# EAGLE design SFFV.10 (EAGLE 6.5.0)
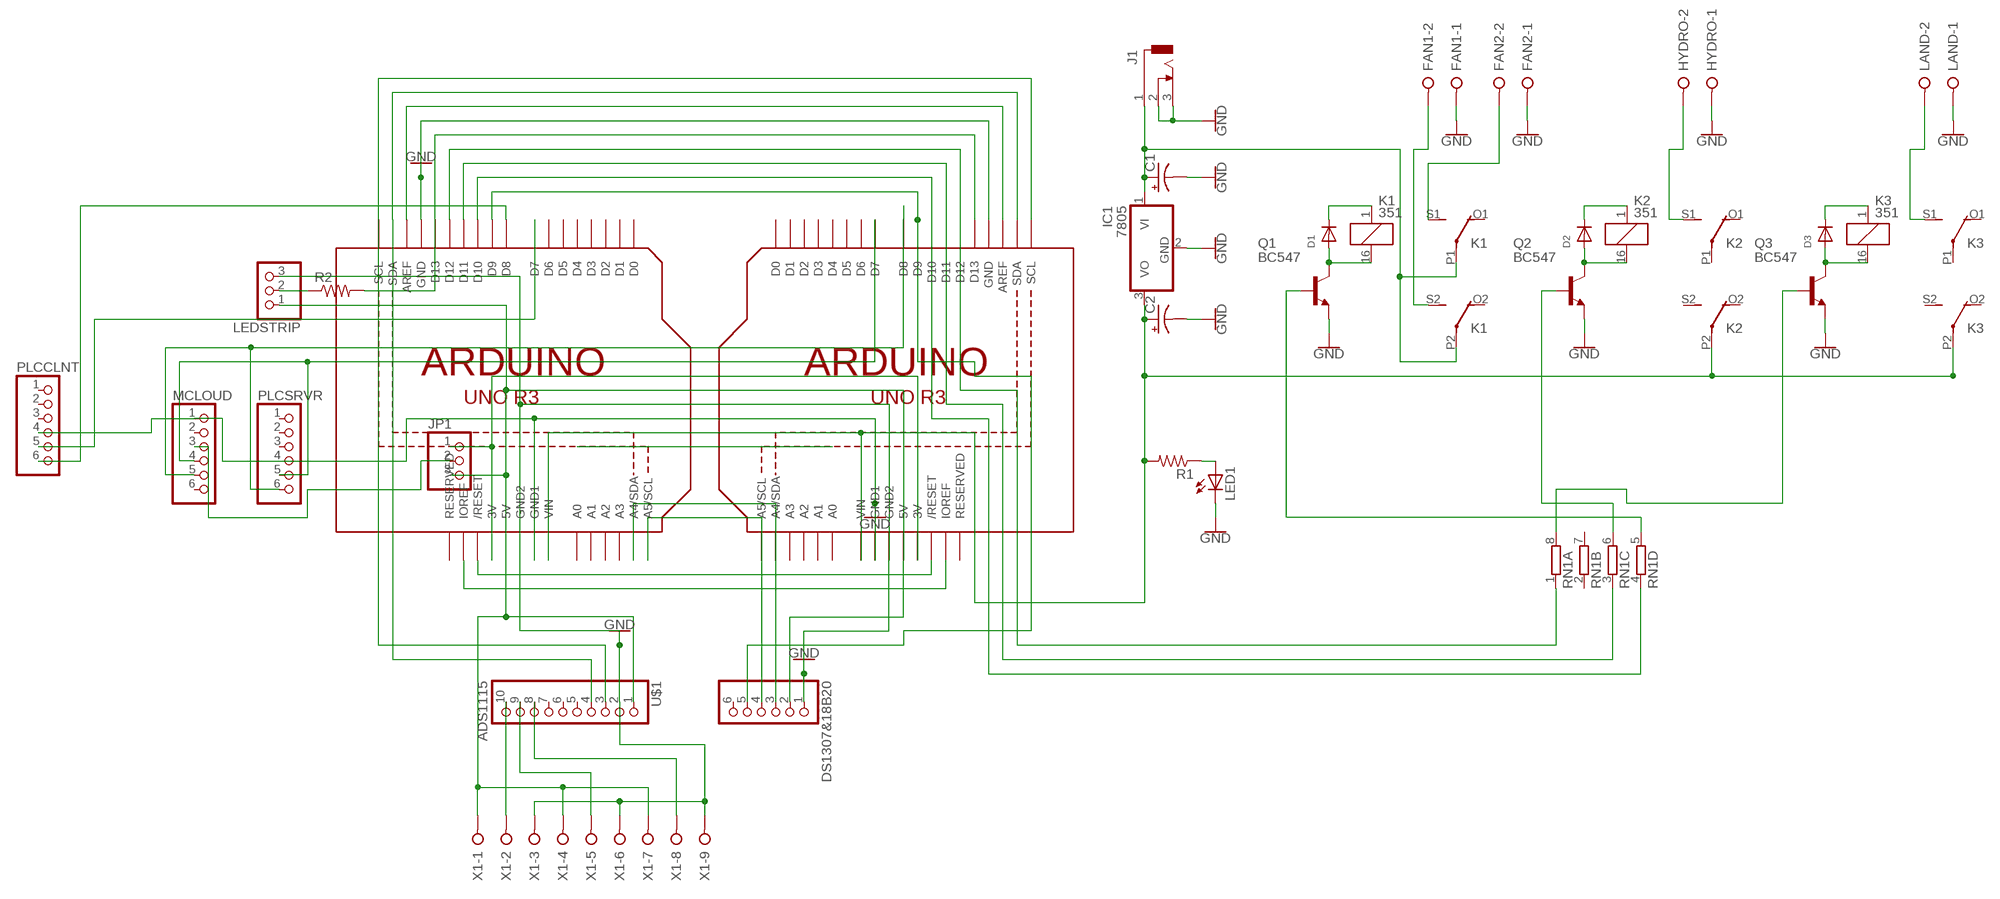
[diagram p0: schematic, sheet 1]

## Parts
C1  CPOL-USE  [PANASONIC_E]
C2  CPOL-USE  [PANASONIC_E]
D1  DIODESMA  [SMADIODE]
D2  DIODESMA  [SMADIODE]
D3  DIODESMA  [SMADIODE]
DS1307&18B20  PINHD-1X6B  [1X06-BIG]
FAN1  W237-02P  [W237-132]
FAN2  W237-02P  [W237-132]
HYDRO  W237-02P  [W237-132]
IC1  7805  7805T  [TO220H]
J1  DCJ0303  [DCJ0303]
JP1  PINHD-1X3CB  [1X03-CLEANBIG]
K1  351  [351]
K2  351  [351]
K3  351  [351]
LAND  W237-02P  [W237-132]
LED1  LED5MM  [LED5MM]
LEDSTRIP  PINHD-1X3  [1X03]
MCLOUD  PINHD-1X6B  [1X06-BIG]
PLCCLNT  PINHD-1X6B  [1X06-BIG]
PLCSRVR  PINHD-1X6B  [1X06-BIG]
Q1  BC547  [TO92]
Q2  BC547  [TO92]
Q3  BC547  [TO92]
R1  R-US_MELF0207W  [MINI_MELF-0207W]
R2  R-US_MELF0207W  [MINI_MELF-0207W]
RN1  4R-NEXB38V  [EXB38V]
U1  ARDUINOR3-BPLACE  [ARDUINOR3-BPLACE]
U2  ARDUINOR3-BPLACE  [ARDUINOR3-BPLACE]
U$1  ADS1115  PINHD-1X10  [1X10-BIG]
X1  W237-09P  [W237-9P]

## Nets
GND: C1.- C2.- DS1307&18B20.1 FAN1.1 FAN2.1 HYDRO.1 IC1.2(GND) J1.2 J1.3 LAND.1 LED1.K(C) LEDSTRIP.3 MCLOUD.1 PLCCLNT.4 PLCSRVR.4 Q1.1(E) Q2.1(E) Q3.1(E) U1.GND U1.GND1 U1.GND2 U2.GND U2.GND1 U2.GND2 U$1.2 X1.3 X1.6 X1.9
N$1: LEDSTRIP.2 R2.1
N$2: LED1.A R1.1
N$5: MCLOUD.4 PLCSRVR.5 U2.D7
N$6: JP1.2 MCLOUD.3
N$8: PLCCLNT.5 U1.D7
N$9: DS1307&18B20.4 U1.A5(A5/SCL) U2.A5(A5/SCL)
N$10: DS1307&18B20.3 U1.A4(A4/SDA) U2.A4(A4/SDA)
N$11: MCLOUD.5 PLCSRVR.6 U2.D8
N$19: JP1.1 U1.3V U2.3V
N$20: U1.RESET(/RESET) U2.RESET(/RESET)
N$21: U1.IOREF U2.IOREF
N$23: PLCCLNT.6 U1.D8
N$24: DS1307&18B20.5 U1.D9 U2.D9
N$25: RN1.4 U1.D10 U2.D10
N$26: RN1.3 U1.D11 U2.D11
N$27: RN1.1 U1.D12 U2.D12
N$28: R2.2 U1.D13 U2.D13
N$30: U1.AREF U2.AREF
N$31: U1.SDA U2.SDA U$1.4
N$32: U$1.10 X1.2
N$33: C1.+ IC1.1(VI) J1.1 K1.P1(2:P) K1.P2(3:P)
N$34: C2.+ IC1.3(VO) K2.P2(3:P) K3.P2(3:P) R1.2 U1.VIN U2.VIN
N$35: Q1.2(B) RN1.5
N$36: Q2.2(B) RN1.6
N$37: HYDRO.2 K2.S1(2:S)
N$38: Q3.2(B) RN1.8
N$39: D1.A K1.16 Q1.3(C)
N$40: D1.C K1.1
N$41: D2.A K2.16 Q2.3(C)
N$42: D2.C K2.1
N$43: D3.A K3.16 Q3.3(C)
N$44: D3.C K3.1
N$45: FAN2.2 K1.S1(2:S)
N$46: FAN1.2 K1.S2(3:S)
N$47: K3.S1(2:S) LAND.2
N$48: U$1.9 X1.5
N$49: U$1.8 X1.8
N$54: U1.SCL U2.SCL U$1.3
PLCCLNT: DS1307&18B20.2 JP1.3 LEDSTRIP.1 U1.5V U2.5V U$1.1 X1.1 X1.4 X1.7
Unconnected: DS1307&18B20.6 K1.O1(2:O) K1.O2(3:O) K2.O1(2:O) K2.O2(3:O) K2.P1(2:P) K2.S2(3:S) K3.O1(2:O) K3.O2(3:O) K3.P1(2:P) K3.S2(3:S) MCLOUD.2 MCLOUD.6 PLCCLNT.1 PLCCLNT.2 PLCCLNT.3 PLCSRVR.1 PLCSRVR.2 PLCSRVR.3 RN1.2 RN1.7 U1.A0 U1.A1 U1.A2 U1.A3 U1.D0 U1.D1 U1.D2 U1.D3 U1.D4 U1.D5 U1.D6 U1.RESERVED U2.A0 U2.A1 U2.A2 U2.A3 U2.D0 U2.D1 U2.D2 U2.D3 U2.D4 U2.D5 U2.D6 U2.RESERVED U$1.5 U$1.6 U$1.7

## Library data of the parts
C1 C2 = adafruit:CPOL-US: POLARIZED CAPACITOR, American symbol
D1-D3 = adafruit:DIODE: Diode SMADIODE - SMA Surface Mount Package 20V 1A Schottky Diode Digikey: 641-1014-6-ND DO-1N4148 - Through Hole Small Current Diode SOD-123 20V 1 A (.5mV Vf) Schottky Diode - Digikey: MBRX120TPMSCT-ND SOD-323 10V 570mA (.38mV Vf, 3ns) Schottky Diode - Digikey: ZLLS410CT-ND SOD-523 30V 30mA Schottky Diode (RB751S-40TE61) - Digikey: RB751S-40TE61CT-ND SOT23-R/W - SOT23 Package (R = Solder Paste/Reflow Ovens, W = Hand-Soldering) BAT54Film 40V 300mA - Digikey: 497-7162-1-ND
DS1307&18B20 MCLOUD PLCCLNT PLCSRVR = adafruit:PINHD-1X6: PIN HEADER
FAN1 FAN2 HYDRO LAND = con-wago-508:W237-02P: WAGO SREW CLAMP; OC_FARNELL: unknown; OC_NEWARK: unknown
IC1 = adafruit:78*: Positive VOLTAGE REGULATOR Added bigger pads to the TO-92 package
J1 = con-jack (2):DCJ0303: DC POWER JACK Source: DCJ0303.pdf
JP1 LEDSTRIP = adafruit:PINHD-1X3: PIN HEADER
K1-K3 = relay:351: RELAY 2 x switch, Omron; OC_FARNELL: unknown; OC_NEWARK: unknown
LED1 = adafruit:LED: LED OSRAM: - CHIPLED LG R971, LG N971, LY N971, LG Q971, LY Q971, LO R971, LY R971 LH N974, LH R974 LS Q976, LO Q976, LY Q976 LO Q996 - Hyper CHIPLED LW Q18S LB Q993, LB Q99A, LB R99A - SideLED LS A670, LO A670, LY A670, LG A670, LP A670 LB A673, LV A673, LT A673, LW A673 LH A674 LY A675 LS A676, LA A676, LO A676, LY A676, LW A676 LS A679, LY A679, LG A679 - Hyper Micro SIDELED® LS Y876, LA Y876, LO Y876, LY Y876 LT Y87S - SmartLED LW L88C, LW L88S LB L89C, LB L89S, LG L890 LS L89K, LO L89K, LY L89K LS L896, LA L896, LO L896, LY L896 - TOPLED LS T670, LO T670, LY T670, LG T670, LP T670 LSG T670, LSP T670, LSY T670, LOP T670, LYG T670 LG T671, LOG T671, LSG T671 LB T673, LV T673, LT T673, LW T673 LH T674 LS T676, LA T676, LO T676, LY T676, LB T676, LH T676, LSB T676, LW T676 LB T67C, LV T67C, LT T67C, LS T67K, LO T67K, LY T67K, LW E67C LS E67B, LA E67B, LO E67B, LY E67B, LB E67C, LV E67C, LT E67C LW T67C LS T679, LY T679, LG T679 LS T770, LO T770, LY T770, LG T770, LP T770 LB T773, LV T773, LT T773, LW T773 LH T774 LS E675, LA E675, LY E675, LS T675 LS T776, LA T776, LO T776, LY T776, LB T776 LHGB T686 LT T68C, LB T68C - Hyper Mini TOPLED® LB M676 - Mini TOPLED Santana® LG M470 LS M47K, LO M47K, LY M47K Source: http://www.osram.convergy.de/
Q1-Q3 = transistor-npn:BC547*: NPN Transistor
R1 R2 = adafruit:R-US_: RESISTOR, American symbol
RN1 = resistor-dil:4R-N: Array Chip Resistor Source: RS Component / Phycomp; OC_FARNELL: unknown; OC_NEWARK: unknown
U1 U2 = adafruit:ARDUINOR3: This is a new object for the new Arduino R3 - with extra pins that you may want to use (such as IOref, and duplicated A4/A5
U$1 = adafruit:PINHD-1X10: Pin header 1x10 0.1" spacing With round pins
X1 = con-wago-508:W237-09P: WAGO SREW CLAMP; OC_FARNELL: unknown; OC_NEWARK: unknown

## Board
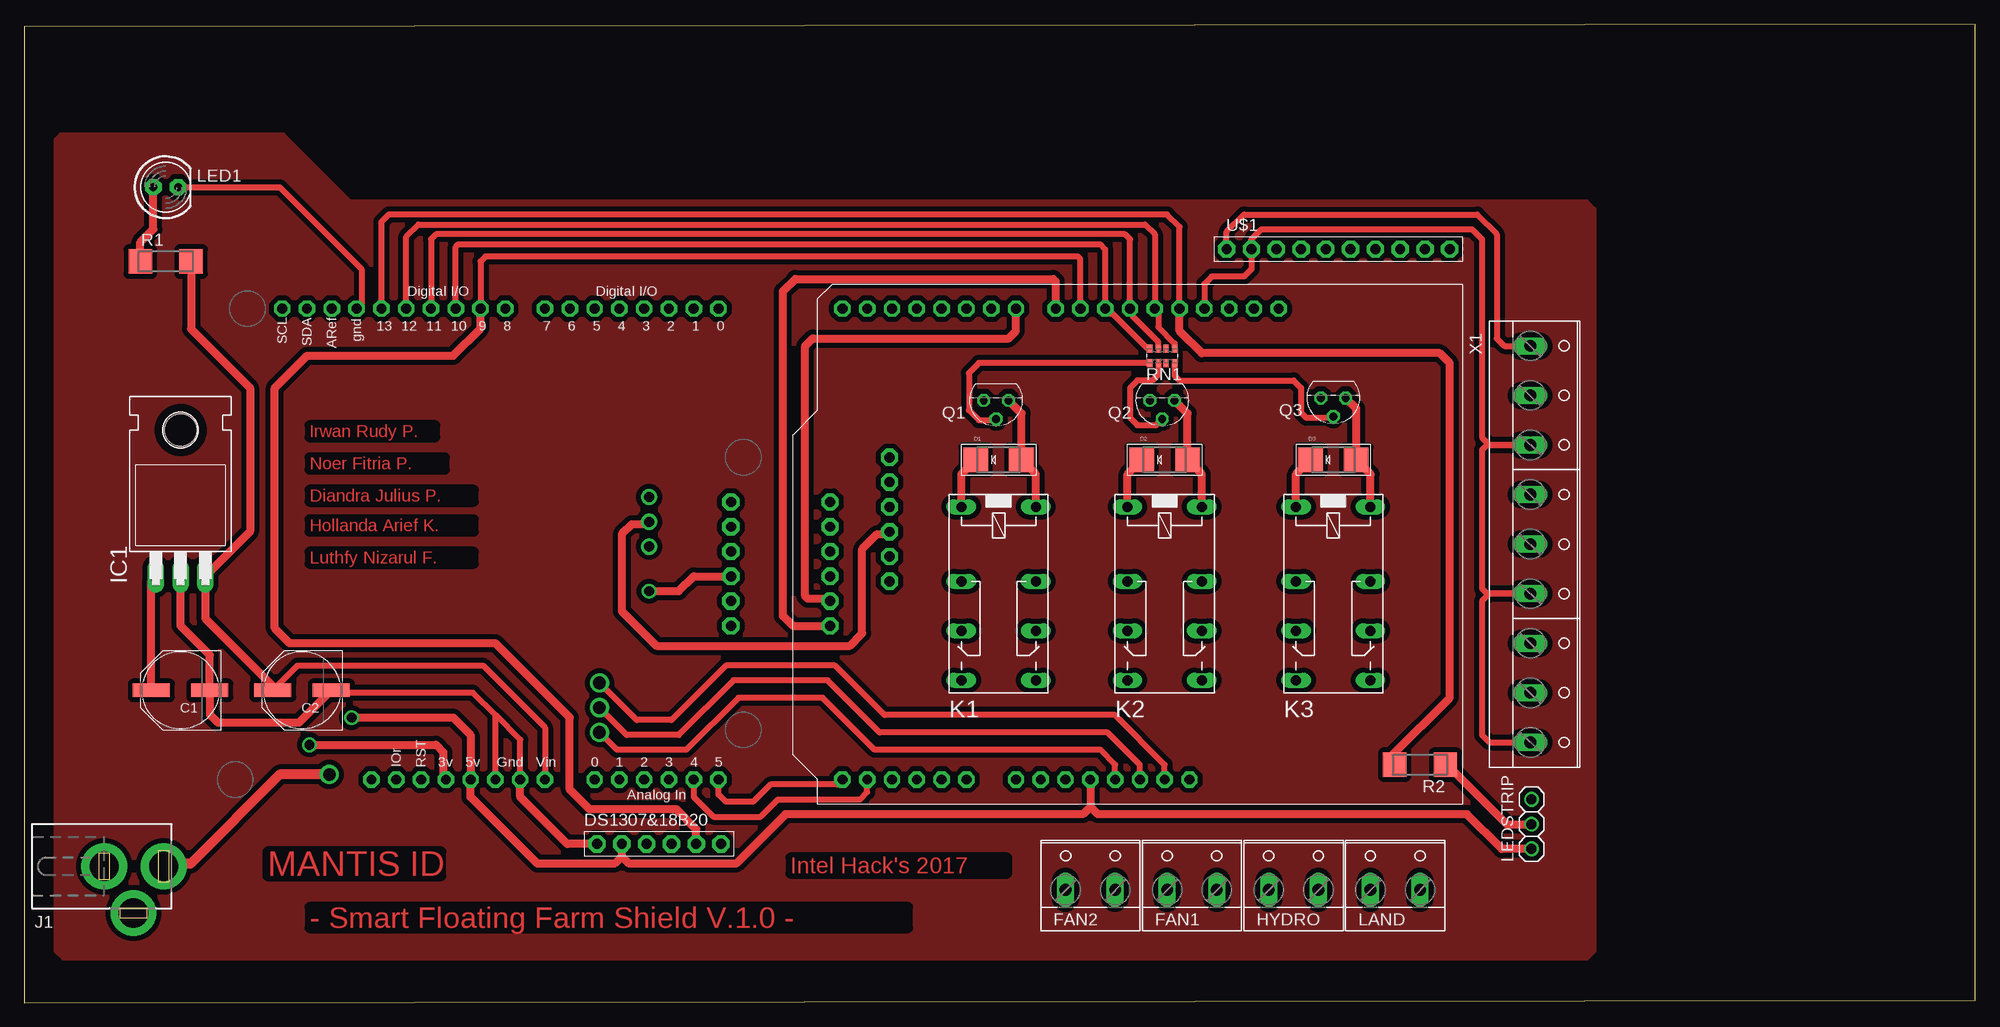
[diagram p1: board, top side]
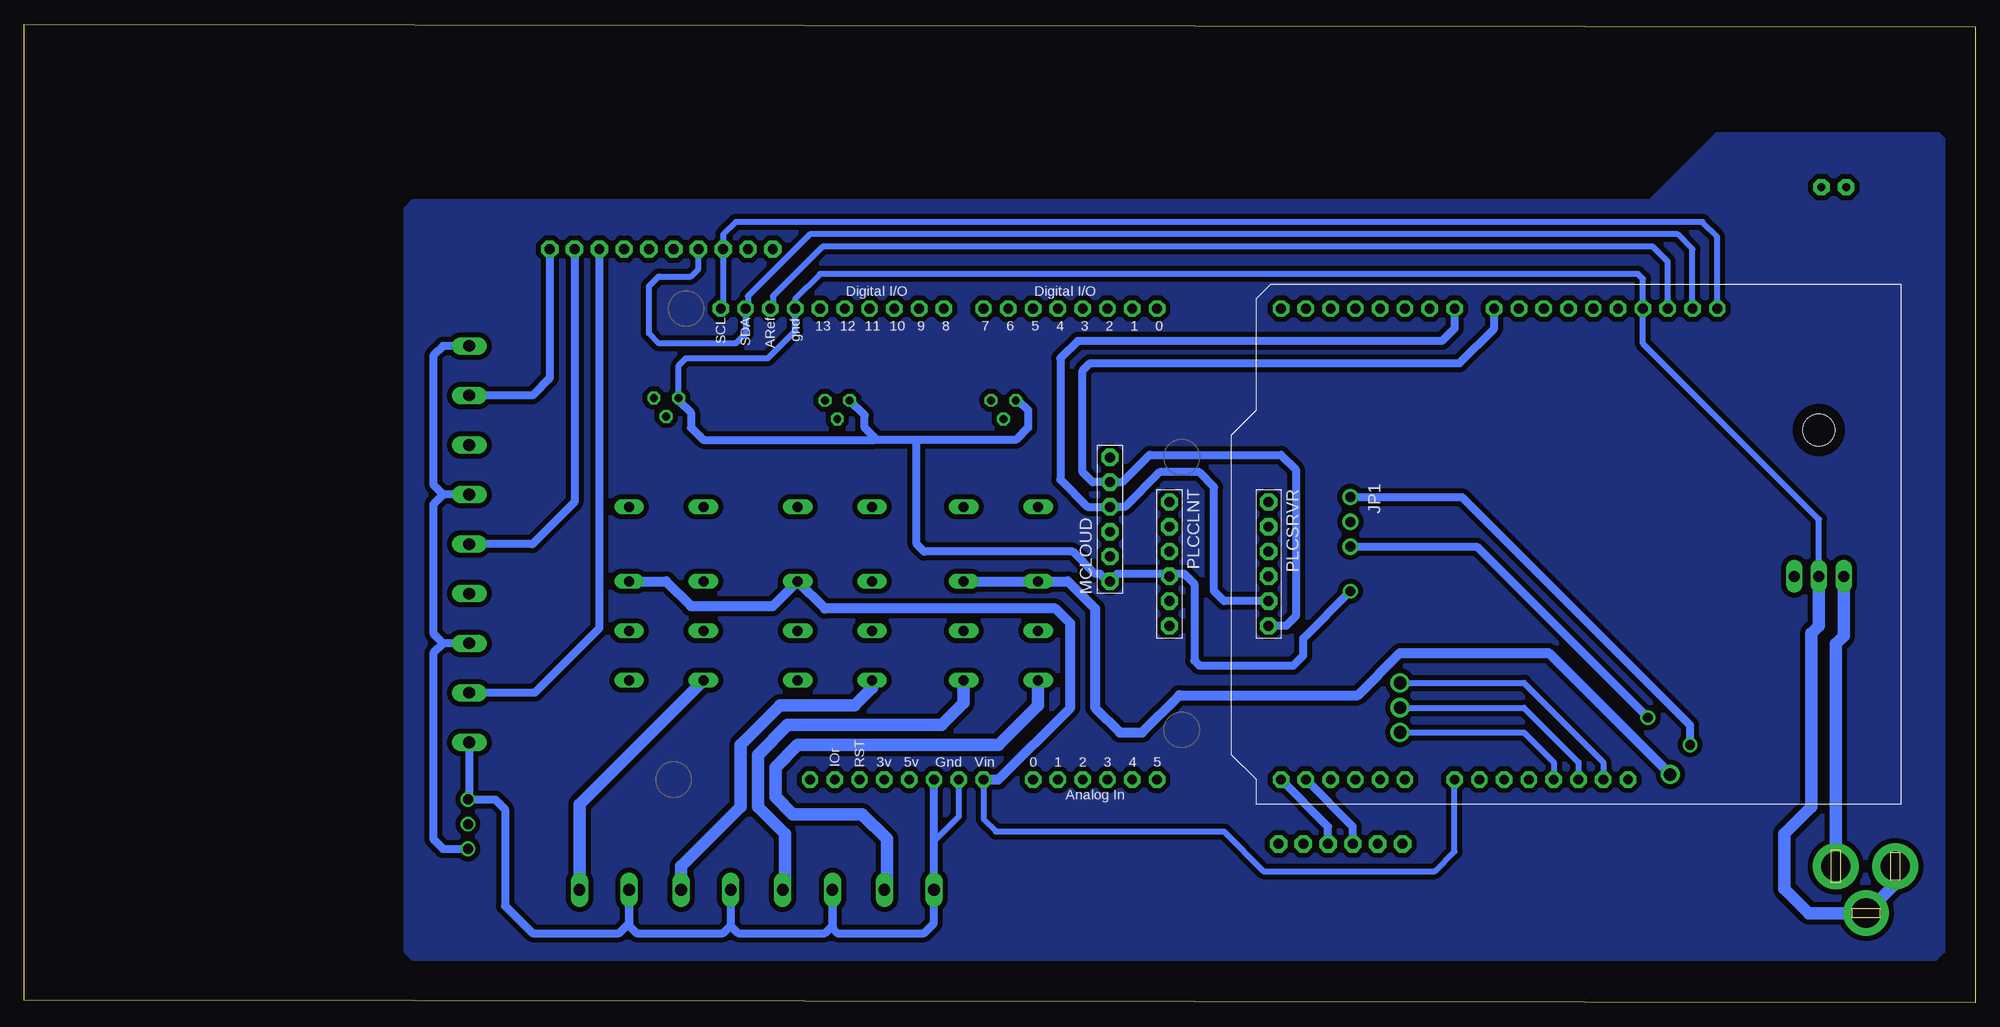
[diagram p2: board, bottom side, seen from below]

Size 199.88 x 100.25 mm. Coordinates in mm from the lower left corner, seen from the top.
Outline: 0,0 199.88,0.25 199.88,100.25 0,100 0,0
Copper layers (1*16): Top 0.035mm / dielectric 1.5mm / Bottom 0.035mm
Design rules "default *": minimum track width 10mil, minimum drill 24mil, track to track 20mil, track to pad 20mil, pad to pad 20mil, via to via 20mil, smd to smd 20mil, copper to edge 40mil, drill to drill 8mil, minimum pad ring 10mil, minimum via ring 8mil, stop-mask expansion 4mil, vias tented up to drill 0mil, thermal gap 10mil

### Footprints (pad centres in the part's own frame; a part is rotated, then mirrored left to right if it is on the bottom)
PANASONIC_E = smd 3.8 x 1.4: + 3,0; - -3,0
SMADIODE = smd 2.54 x 2.54: A 2.349,0; C -2.349,0
1X06-BIG = drill 1.016 pad 1.778 octagon: 1 -6.35,0; 2 -3.81,0; 3 -1.27,0; 4 1.27,0; 5 3.81,0; 6 6.35,0
W237-132 = drill 1.194 long: 1 -2.54,-0.635; 2 2.54,-0.635
TO220H = drill 1.118 long: 1 -2.54,-10.16; 2 0,-10.16; 3 2.54,-10.16 | hole 3.302: 0,4.826
DCJ0303 = drill 3 pad 4.7: 1 0,3.1; 2 4.8,0; 3 0,-3
1X03-CLEANBIG = drill 1.016 pad 1.676: 1 -2.54,0; 2 0,0; 3 2.54,0
351 = drill 1.016 long: 1 -3.81,-3.81; 16 -3.81,3.81; O1 8.89,-3.81; O2 8.89,3.81; P1 3.81,-3.81; P2 3.81,3.81; S1 13.97,-3.81; S2 13.97,3.81
LED5MM = drill 0.813 pad 1.676 octagon: A -1.27,0; K 1.27,0
1X03 = drill 1.016: 1 -2.54,0; 2 0,0; 3 2.54,0
TO92 = drill 0.813 octagon: 1 1.27,0; 2 0,1.905; 3 -1.27,0
MINI_MELF-0207W = smd 2.4 x 2.5: 1 -2.6,0; 2 2.6,0
EXB38V = smd 0.6 x 0.8: 1 -1.275,-0.75; 4 1.275,-0.75; 5 1.275,0.75; 8 -1.275,0.75 | smd 0.5 x 0.8: 2 -0.4,-0.75; 3 0.4,-0.75; 6 0.4,0.75; 7 -0.4,0.75
ARDUINOR3-BPLACE = drill 1 pad 1.676 octagon: 3V 35.56,2.54; 5V 38.1,2.54; A0 50.8,2.54; A1 53.34,2.54; A2 55.88,2.54; A3 58.42,2.54; A4 60.96,2.54; A5 63.5,2.54; AREF 23.876,50.8; D0 63.5,50.8; D1 60.96,50.8; D2 58.42,50.8; D3 55.88,50.8; D4 53.34,50.8; D5 50.8,50.8; D6 48.26,50.8; D7 45.72,50.8; D8 41.656,50.8; D9 39.116,50.8; D10 36.576,50.8; D11 34.036,50.8; D12 31.496,50.8; D13 28.956,50.8; GND 26.416,50.8; GND1 43.18,2.54; GND2 40.64,2.54; IOREF 30.48,2.54; RESERVED 27.94,2.54; RESET 33.02,2.54; SCL 18.796,50.8; SDA 21.336,50.8; VIN 45.72,2.54
1X10-BIG = drill 1.016 pad 1.778 octagon: 1 -11.43,0; 2 -8.89,0; 3 -6.35,0; 4 -3.81,0; 5 -1.27,0; 6 1.27,0; 7 3.81,0; 8 6.35,0; 9 8.89,0; 10 11.43,0
W237-9P = drill 1.194 long: 1 -20.32,-0.635; 2 -15.24,-0.635; 3 -10.16,-0.635; 4 -5.08,-0.635; 5 0,-0.635; 6 5.08,-0.635; 7 10.16,-0.635; 8 15.24,-0.635; 9 20.32,-0.635

### Placement (x,y rotation side)
C1  16,32 180 top
C2  28.45,32 180 top
D1  99.82,55.63 0 top
D2  116.84,55.63 0 top
D3  134.11,55.63 0 top
DS1307&18B20  65.02,16.26 0 top
FAN1  119.63,12.19 0 top
FAN2  109.22,12.19 0 top
HYDRO  130.05,12.19 0 top
IC1  16,53.85 0 top
J1  11.18,13.97 270 top
JP1  64.01,49.28 270 bottom
K1  99.82,46.99 270 top
K2  116.84,46.99 270 top
K3  134.11,46.99 270 top
LAND  140.46,12.19 0 top
LED1  14.48,83.57 0 top
LEDSTRIP  154.43,18.29 90 top
MCLOUD  88.65,49.53 90 bottom
PLCCLNT  82.55,44.96 270 bottom
PLCSRVR  72.39,44.96 270 bottom
Q1  99.57,61.72 180 top
Q2  116.59,61.72 180 top
Q3  134.11,61.98 180 top
R1  14.48,75.95 0 top
R2  143,24.38 180 top
RN1  116.59,66.29 180 top
U1  147.32,20.32 0 bottom
U2  7.62,20.32 0 top
U$1  134.62,77.22 0 top
X1  154.94,46.99 270 top

### Tracks (layer width: path | path; a pad name or v marks a point on that pad's centre or on a via)
GND  (via drill 1 pad 0.61)
  Top 0.61: X1.9 150.11,26.67 149.35,27.43 149.35,41.15 150.11,41.91 X1.6 149.86,41.91 149.35,42.42 149.35,56.64 149.86,57.15 X1.3 150.11,57.15 149.35,57.91 149.35,78.23 148.34,79.25 126.75,79.25 125.73,78.23 U$1.2 125.73,75.18 124.97,74.42 121.67,74.42 120.9,73.66 U1.GND | LED1.K 26.16,83.57 34.54,75.18 34.54,71.63 U2.GND | U2.GND2 48.26,29.46 | 48.26,29.46 45.97,31.75 33.48,31.75 C2.- | U2.GND1 50.8,26.92 48.26,29.46
  Top 0.813: DS1307&18B20.1 55.63,16.26 50.8,21.08 U2.GND1 | IC1.2 16,38.61 19,35.61 C1.- 19,29.51 19.81,28.7 28.15,28.7 C2.- | v64.01,42.16 67.06,42.16 68.58,43.69 PLCSRVR.4
  Bottom 0.61: Q3.1 132.84,65.28 132.08,66.04 123.7,66.04 120.9,68.83 U1.GND 120.9,72.14 118.36,74.68 34.54,74.68 34.04,74.17 U2.GND 34.04,67.56 16,49.53 IC1.2 | U1.GND1 104.14,19.05 106.68,16.51
  Bottom 0.813: Q1.1 98.04,61.72 97.03,60.71 97.03,58.93 98.3,57.66 108.2,57.66 | 108.2,57.66 112.52,57.66 112.65,57.78 | 112.65,57.78 113.79,58.93 113.79,60.2 Q2.1 | Q3.1 132.84,61.72 131.57,60.45 131.57,58.93 130.3,57.66 112.78,57.66 112.65,57.78 | X1.9 154.31,20.95 LEDSTRIP.3 151.64,20.83 150.62,19.81 150.62,9.91 147.83,7.11 138.94,7.11 137.92,8.13 LAND.1 137.92,7.87 137.16,7.11 128.27,7.11 127.51,7.87 | HYDRO.1 127.51,7.87 | 127.51,7.87 126.75,7.11 117.86,7.11 117.09,7.87 FAN1.1 117.09,7.62 116.59,7.11 107.7,7.11 106.68,8.13 FAN2.1 106.68,16.51 U1.GND2 | v64.01,42.16 68.83,37.34 68.83,35.56 69.85,34.54 79.5,34.54 80.01,35.05 80.01,42.93 81.03,43.94 82.3,43.94 PLCCLNT.4 82.8,43.94 87.88,43.94 MCLOUD.1 88.9,43.18 89.66,43.94 90.17,43.94 92.46,46.23 107.7,46.23 108.46,46.99 108.46,57.4 108.2,57.66
  Bottom 1.27: J1.3 8.18,12.17 J1.2 11.2,9.14 17.02,9.14 19.56,11.68 19.56,17.27 16.76,20.07 16.76,37.85 16,38.61 IC1.2
N$1
  Top 0.813: R2.1 145.8,24.38 151.89,18.29 LEDSTRIP.2
N$2
  Top 0.813: R1.1 11.88,77.92 13.21,79.25 LED1.A
N$3
  pour Top: 3.3,88.39 3.81,88.9 26.42,88.9 33.27,82.04 160.02,82.04 160.78,81.28 160.78,5.33 160.02,4.57 4.06,4.57 3.3,5.33 3.3,88.14
N$4
  pour Bottom: 3.3,88.39 3.81,88.9 26.42,88.9 33.27,82.04 160.02,82.04 160.78,81.28 160.78,5.33 160.02,4.57 4.06,4.57 3.3,5.33
N$5
  Bottom 0.813: U2.D7 53.34,69.09 54.61,67.82 91.95,67.82 93.73,66.04 93.73,53.59 90.93,50.8 MCLOUD.4 87.12,50.8 83.57,54.36 79.5,54.36 77.98,52.83 77.98,42.16 76.96,41.15 PLCSRVR.5
N$6
  Top 0.813: JP1.2 63.75,49.02 62.23,49.02 61.21,48.01 61.21,40.13 64.77,36.58 84.58,36.58 85.85,37.85 85.85,46.48 87.38,48.01 88.39,48.01 MCLOUD.3
N$8
  Top 0.813: U1.D7 101.6,68.83 100.84,68.07 80.77,68.07 80.01,67.31 80.01,41.66 80.26,41.4 82.3,41.4 PLCCLNT.5
N$9
  Top 0.61: U1.A5 83.31,22.35 76.45,22.35 74.68,20.57 71.88,20.57 71.12,21.34 U2.A5
  Bottom 0.813: DS1307&18B20.4 66.29,18.03 U2.A5
N$10
  Top 0.61: U2.A4 68.58,21.08 70.61,19.05 75.44,19.05 77.22,20.83 85.6,20.83 86.36,21.59 U1.A4
  Bottom 0.813: DS1307&18B20.3 63.75,18.03 U2.A4
N$11
  Bottom 0.813: U2.D8 49.28,69.09 52.83,65.53 90.68,65.53 91.44,64.77 91.44,54.36 90.42,53.34 MCLOUD.5 87.38,53.34 84.58,56.13 71.12,56.13 69.6,54.61 69.6,39.62 70.61,38.61 PLCSRVR.6
N$19  (via drill 1 pad 0.61, 1.3 pad 1.02)
  Top 0.61: U1.3V 111.76,24.38 110.24,25.91 87.12,25.91 81.79,31.24 73.15,31.24 67.82,25.91 60.71,25.91 v58.93,27.69
  Top 0.813: v29.21,26.42 42.16,26.42 42.93,25.65 42.93,23.11 U2.3V
  Bottom 0.61: v58.93,27.69 46.23,27.69 43.18,24.64 U2.3V
  Bottom 0.813: JP1.1 52.58,51.82 29.21,28.45 v29.21,26.42
N$20  (via drill 1.3 pad 1.02)
  Top 0.61: U1.RESET 114.3,24.38 111,27.69 87.63,27.69 82.3,33.02 72.64,33.02 67.06,27.43 61.72,27.43 v58.93,30.23
  Bottom 0.61: v58.93,30.23 46.23,30.23 40.64,24.64 U2.RESET
N$21  (via drill 1.3 pad 1.02)
  Top 0.61: U1.IOREF 116.84,24.38 111.76,29.46 88.14,29.46 83.06,34.54 71.88,34.54 66.29,28.96 62.74,28.96 v58.93,32.77
  Bottom 0.61: v58.93,32.77 46.23,32.77 38.1,24.64 U2.IOREF
N$23
  Top 0.813: U1.D8 105.66,73.91 105.41,74.17 78.99,74.17 77.72,72.9 77.72,39.62 78.74,38.61 PLCCLNT.6
N$24
  Top 0.61: U1.D9 108.2,76.2 107.95,76.45 47.24,76.45 46.74,75.95 U2.D9
  Top 0.813: DS1307&18B20.5 68.83,17.78 66.8,19.81 57.91,19.81 55.88,21.84 55.88,29.21 48.26,36.83 27.18,36.83 25.65,38.35 25.65,62.99 28.96,66.29 43.94,66.29 46.74,69.09 U2.D9
N$25
  Top 0.61: RN1.4 115.07,67.04 111.51,70.61 111.25,70.61 U1.D10 110.74,77.22 110.24,77.72 44.45,77.72 44.2,77.47 U2.D10
N$26
  Top 0.61: RN1.3 116.19,67.71 113.54,70.36 113.54,70.87 U1.D11 113.28,78.23 112.78,78.74 42.16,78.74 41.66,78.23 U2.D11
N$27
  Top 0.61: 115.57,71.37 U1.D12 | U1.D12 116.19,70.76 116.19,69.23 117.86,67.56 RN1.1 | U2.D12 39.12,78.49 40.39,79.76 114.81,79.76 115.82,78.74 U1.D12
N$28
  Top 0.61: U1.D13 118.36,79.5 117.09,80.77 37.34,80.77 36.58,80.01 U2.D13
  Top 0.813: 139.89,25.09 140.08,25.27 | 140.08,25.27 146.05,31.24 146.05,65.53 145.03,66.55 120.65,66.55 118.36,68.83 U1.D13 | R2.2 140.4,24.95 140.08,25.27
N$30
  Bottom 0.61: U2.AREF 31.5,75.95 33.02,77.47 118.11,77.47 123.19,72.39 123.19,71.37 U1.AREF
N$31
  Bottom 0.61: U2.SDA 28.96,77.22 30.48,78.74 119.38,78.74 125.73,72.39 125.73,71.37 | 125.73,71.37 U1.SDA | 125.73,71.37 125.73,70.87 125.98,70.61 125.98,68.58 127,67.56 134.87,67.56 135.89,68.58 135.89,73.41 134.87,74.42 131.57,74.42 130.81,75.18 U$1.4
N$32
  Bottom 0.813: U$1.10 146.05,64.01 147.83,62.23 X1.2
N$33  (via drill 1.3 pad 1.02)
  Top 0.813: C1.+ 13,43.23 IC1.1
  Top 1.016: v31.24,23.37 26.16,23.37 17.02,14.22 14.53,14.22 J1.1
  Bottom 1.016: K1.P2 K1.P1 92.96,43.18 90.17,40.39 90.17,30.23 87.63,27.69 85.34,27.69 81.53,31.5 63.25,31.5 58.93,35.81 43.69,35.81 v31.24,23.37
  Bottom 1.27: J1.1 14.28,36.78 13.46,37.59 IC1.1
N$34
  Top 0.61: U2.VIN 53.34,28.19 46.99,34.54 27.99,34.54 C2.+
  Top 0.813: C2.+ 25.91,32 18.54,39.37 IC1.3 23.11,48.26 23.11,62.99 17.08,69.03 R1.2
  Bottom 0.61: U1.VIN 101.6,18.8 100.33,17.53 76.96,17.53 72.9,13.46 55.37,13.46 53.34,15.49 U2.VIN
  Bottom 1.016: K3.P2 134.11,43.18 131.57,40.64 123.19,40.64 K2.P2 117.86,40.39 94.23,40.39 92.71,38.86 92.71,30.23 100.08,22.86 U1.VIN
N$35
  Top 0.61: RN1.5 97.8,65.54 96.77,64.52 96.77,60.71 97.79,59.69 99.44,59.69 Q1.2
N$36
  Top 0.61: RN1.6 116.19,64.37 115.57,63.75 114.05,63.75 113.28,62.99 113.28,59.94 114.05,59.18 115.95,59.18 Q2.2
N$37
  Bottom 1.27: HYDRO.2 132.59,13.97 126.49,20.07 126.49,26.42 122.43,30.48 114.81,30.48 113.03,32.26 K2.S1
N$38
  Top 0.61: RN1.8 117.86,64.26 118.36,63.75 130.05,63.75 130.81,62.99 130.81,60.45 131.32,59.94 133.99,59.94 Q3.2
N$39
  Top 0.813: K1.16 103.63,54.17 D1.A 102.17,60.39 Q1.3
N$40
  Top 0.813: K1.1 96.01,54.17 D1.C
N$41
  Top 0.813: K2.16 120.65,54.17 D2.A 119.19,60.39 Q2.3
N$42
  Top 0.813: K2.1 113.03,54.17 D2.C
N$43
  Top 0.813: K3.16 137.92,54.17 D3.A 136.46,60.9 Q3.3
N$44
  Top 0.813: K3.1 130.3,54.17 D3.C
N$45
  Bottom 1.27: K1.S1 96.01,30.48 100.08,26.42 120.65,26.42 122.94,24.13 122.94,21.08 121.16,19.3 114.05,19.3 111.51,16.76 111.51,11.81 FAN2.2
N$46
  Bottom 1.27: K1.S2 103.63,30.73 105.92,28.45 121.67,28.45 124.71,25.4 124.71,20.07 121.92,17.27 121.92,11.81 FAN1.2
N$47
  Bottom 1.27: LAND.2 143,20.32 K3.S1
N$48
  Bottom 0.813: U$1.9 143.51,51.31 147.83,46.99 X1.5
N$49
  Bottom 0.813: U$1.8 140.97,38.35 147.57,31.75 X1.8
N$54
  Bottom 0.61: U2.SCL 26.42,78.49 27.94,80.01 127,80.01 128.27,78.74 U$1.3 128.27,71.37 U1.SCL
PLCCLNT  (via drill 1 pad 0.61)
  Top 0.61: U$1.1 123.19,78.99 124.97,80.77 148.84,80.77 150.88,78.74 150.88,68.07 151.64,67.31 X1.1
  Top 0.813: LEDSTRIP.1 151.38,15.75 147.83,19.3 109.98,19.3 109.22,20.07 | DS1307&18B20.2 61.21,14.99 | 61.21,14.99 60.45,14.22 52.58,14.22 45.72,21.08 U2.5V 45.72,27.43 43.94,29.21 v33.53,29.21 | U1.5V 109.22,20.07 | 109.22,20.07 108.46,19.3 77.98,19.3 72.9,14.22 61.98,14.22 61.21,14.99
  Bottom 0.813: X1.1 156.97,67.31 157.99,66.29 157.99,53.09 156.97,52.07 | X1.4 156.97,52.07 | 156.97,52.07 157.99,51.05 157.99,37.85 156.97,36.83 | X1.7 156.97,36.83 | 156.97,36.83 157.99,35.81 157.99,16.76 156.97,15.75 LEDSTRIP.1 | JP1.3 51.05,46.74 v33.53,29.21

### Text on the board
Top: Irwan Rudy P. | Noer Fitria P. | Diandra Julius P. | Hollanda Arief K. | Luthfy Nizarul F. | MANTIS ID | Intel Hack's 2017 | - Smart Floating Farm Shield V.1.0 -